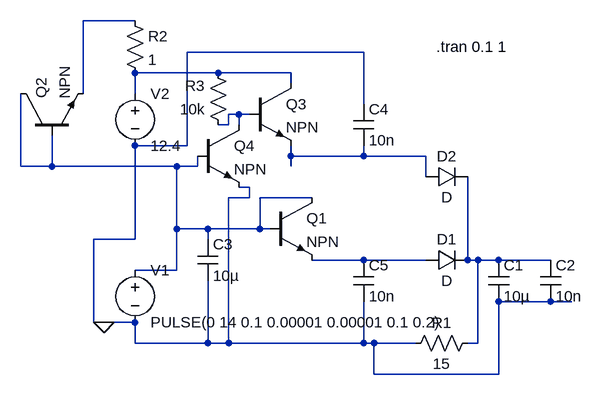
[diagram p0: schematic Draft26.asc]
Draft26.asc, the LTspice schematic file:
Version 4
SHEET 1 880 680
WIRE 176 32 96 32
WIRE 528 80 256 80
WIRE 304 112 176 112
WIRE 416 112 304 112
WIRE 416 128 416 112
WIRE 96 144 96 32
WIRE 176 144 176 112
WIRE 528 160 528 80
WIRE 336 176 320 176
WIRE 352 176 336 176
WIRE 320 192 320 176
WIRE 320 192 304 192
WIRE 336 192 336 176
WIRE 256 224 256 80
WIRE 256 224 176 224
WIRE 416 240 416 224
WIRE 528 240 528 224
WIRE 528 240 416 240
WIRE 624 240 528 240
WIRE 0 256 0 144
WIRE 48 256 48 208
WIRE 48 256 0 256
WIRE 240 256 48 256
WIRE 272 256 272 240
WIRE 272 256 240 256
WIRE 416 256 416 240
WIRE 624 272 624 240
WIRE 352 288 336 288
WIRE 352 304 352 288
WIRE 352 304 320 304
WIRE 448 304 368 304
WIRE 240 352 240 256
WIRE 288 352 240 352
WIRE 368 352 368 304
WIRE 368 352 288 352
WIRE 384 352 368 352
WIRE 176 368 176 224
WIRE 176 368 112 368
WIRE 288 368 288 352
WIRE 528 400 448 400
WIRE 624 400 528 400
WIRE 688 400 688 272
WIRE 704 400 688 400
WIRE 736 400 704 400
WIRE 816 400 736 400
WIRE 240 416 240 352
WIRE 240 416 176 416
WIRE 816 464 736 464
WIRE 848 464 816 464
WIRE 112 496 112 368
WIRE 128 496 112 496
WIRE 176 496 128 496
WIRE 176 528 176 496
WIRE 288 528 288 432
WIRE 288 528 176 528
WIRE 320 528 320 304
WIRE 320 528 288 528
WIRE 528 528 528 464
WIRE 528 528 320 528
WIRE 544 528 528 528
WIRE 608 528 544 528
WIRE 704 528 704 400
WIRE 704 528 688 528
WIRE 544 576 544 528
WIRE 736 576 736 464
WIRE 736 576 544 576
FLAG 128 496 0
SYMBOL voltage 176 400 R0
SYMATTR InstName V1
SYMATTR Value PULSE(0 14 0.1 0.00001 0.00001 0.1 0.2)
SYMBOL voltage 176 128 R0
SYMATTR InstName V2
SYMATTR Value 12.4
SYMBOL diode 624 416 R270
WINDOW 0 32 32 VTop 2
WINDOW 3 0 32 VBottom 2
SYMATTR InstName D1
SYMBOL res 704 512 R90
WINDOW 0 0 56 VBottom 2
WINDOW 3 32 56 VTop 2
SYMATTR InstName R1
SYMATTR Value 15
SYMBOL cap 720 400 R0
SYMATTR InstName C1
SYMATTR Value 10µ
SYMBOL npn 384 304 R0
SYMATTR InstName Q1
SYMBOL diode 624 288 R270
WINDOW 0 32 32 VTop 2
WINDOW 3 0 32 VBottom 2
SYMATTR InstName D2
SYMBOL cap 800 400 R0
SYMATTR InstName C2
SYMATTR Value 10n
SYMBOL cap 272 368 R0
SYMATTR InstName C3
SYMATTR Value 10µ
SYMBOL npn 0 208 R270
SYMATTR InstName Q2
SYMBOL res 160 16 R0
SYMATTR InstName R2
SYMATTR Value 1
SYMBOL cap 512 160 R0
SYMATTR InstName C4
SYMATTR Value 10n
SYMBOL cap 512 400 R0
SYMATTR InstName C5
SYMATTR Value 10n
SYMBOL npn 352 128 R0
SYMATTR InstName Q3
SYMBOL npn 272 192 R0
SYMATTR InstName Q4
SYMBOL res 320 208 R180
WINDOW 0 36 76 Left 2
WINDOW 3 36 40 Left 2
SYMATTR InstName R3
SYMATTR Value 10k
TEXT 640 72 Left 2 !.tran 0.1 1

The netlist it stands for:
* Draft26.asc
V1 N005 0 PULSE(0 14 0.1 0.00001 0.00001 0.1 0.2)
V2 N002 0 12.4
D1 N006 N007 D
R1 N007 0 15
C1 N007 0 10µ
Q1 N005 N005 N006 0 NPN
D2 N004 N007 D
C2 N007 0 10n
C3 N005 0 10µ
Q2 N005 N005 N001 0 NPN
R2 N001 N002 1
C4 0 N004 10n
C5 N006 0 10n
Q3 N002 N003 N004 0 NPN
Q4 N003 N005 0 0 NPN
R3 N003 N002 10k
.model D D
.lib standard.dio
.model NPN NPN
.model PNP PNP
.lib standard.bjt
.tran 0.1 1
.backanno
.end